# EAGLE design MainBoardR4 (EAGLE 6.5.0)
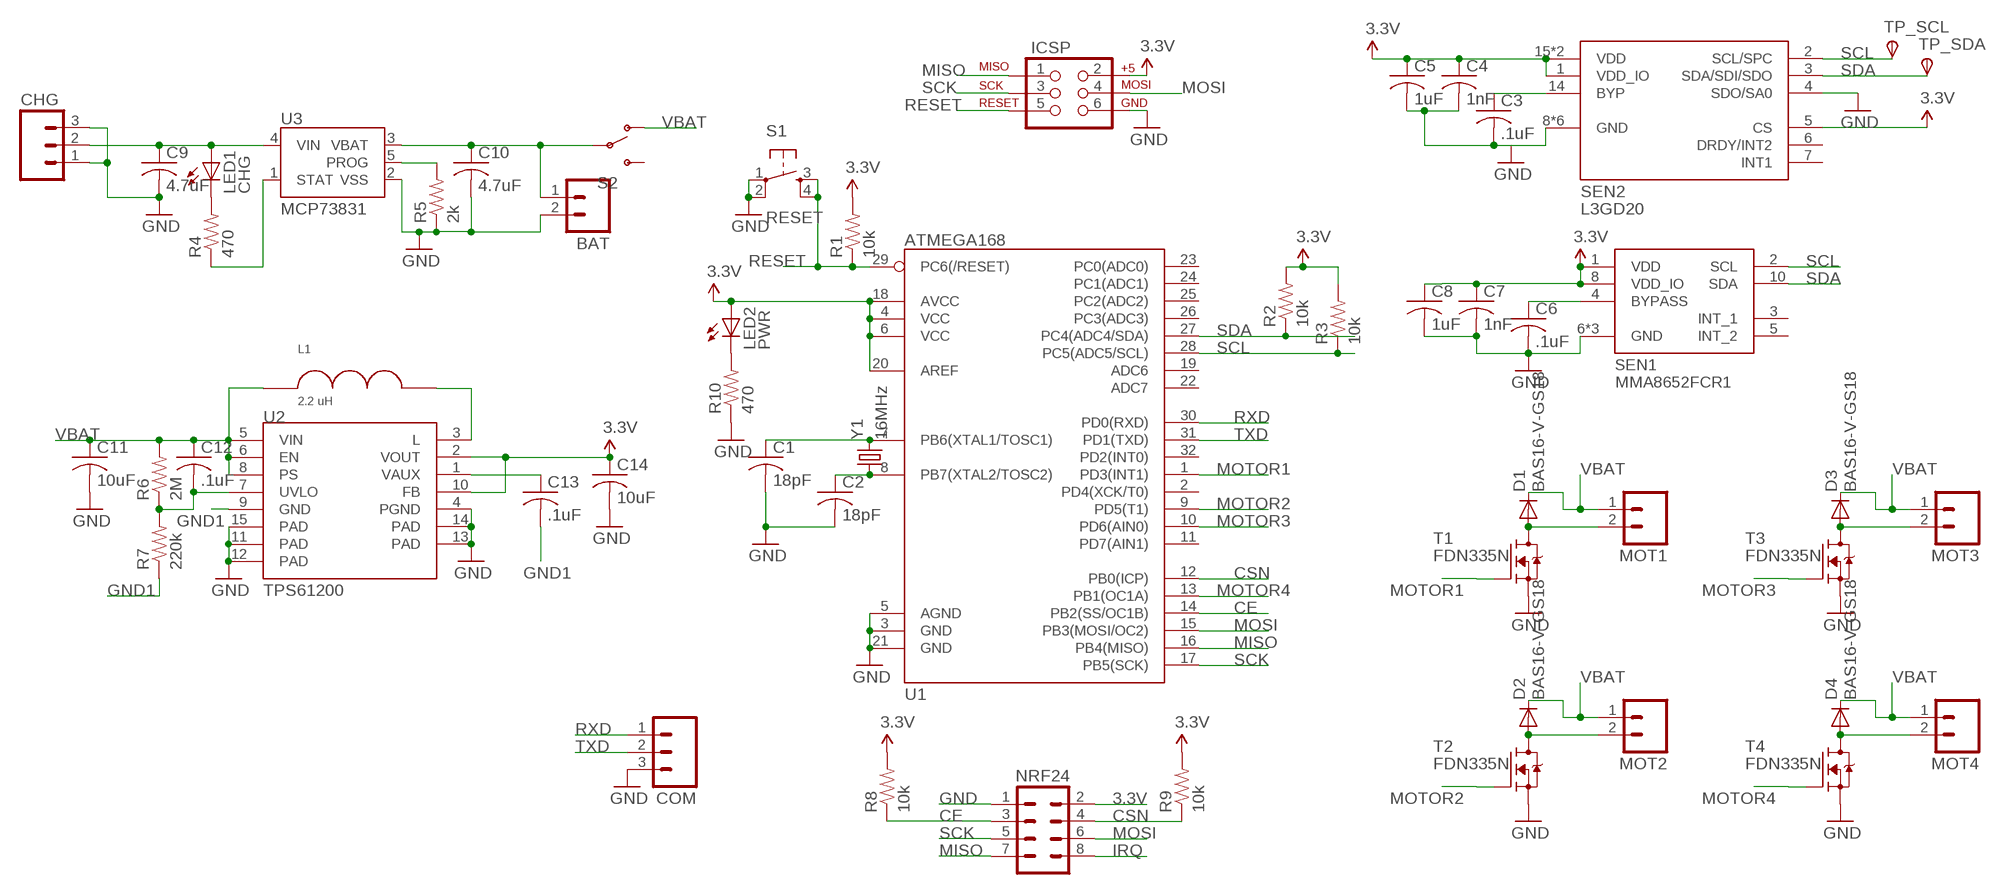
[diagram p0: schematic, sheet 1]

## Parts
BAT  M02LOCK_LONGPADS  [1X02_LOCK_LONGPADS]
C1  18pF  C-USC0805  [C0805]
C2  18pF  C-USC0805  [C0805]
C3  .1uF  C-USC0805  [C0805]
C4  1nF  C-USC0805  [C0805]
C5  1uF  C-USC0805  [C0805]
C6  .1uF  C-USC0805  [C0805]
C7  1nF  C-USC0805  [C0805]
C8  1uF  C-USC0805  [C0805]
C9  4.7uF  C-USC0805  [C0805]
C10  4.7uF  C-USC0805  [C0805]
C11  10uF  C-USC0805  [C0805]
C12  .1uF  C-USC0805  [C0805]
C13  .1uF  C-USC0805  [C0805]
C14  10uF  C-USC0805  [C0805]
CHG  M03LONGPADS  [1X03_LONGPADS]
COM  M03LONGPADS  [1X03_LONGPADS]
D1  BAS16-V-GS18  [SOT23]
D2  BAS16-V-GS18  [SOT23]
D3  BAS16-V-GS18  [SOT23]
D4  BAS16-V-GS18  [SOT23]
ICSP  AVR_SPI_PRG_62X3_LOCK  [2X3_LOCK]
L1  2.2 uH  BRHL2518T2R2M  [2518]
LED1  CHG  LED1206  [LED-1206]
LED2  PWR  LED1206  [LED-1206]
MOT1  M02LOCK_LONGPADS  [1X02_LOCK_LONGPADS]
MOT2  M02LOCK_LONGPADS  [1X02_LOCK_LONGPADS]
MOT3  M02LOCK_LONGPADS  [1X02_LOCK_LONGPADS]
MOT4  M02LOCK_LONGPADS  [1X02_LOCK_LONGPADS]
NRF24  M04X2  [2X4]
R1  10k  RESISTOR0805-RES  [0805]
R2  10k  RESISTOR0805-RES  [0805]
R3  10k  RESISTOR0805-RES  [0805]
R4  470  RESISTOR0805-RES  [0805]
R5  2k  RESISTOR0805-RES  [0805]
R6  2M  RESISTOR0805-RES  [0805]
R7  220k  RESISTOR0805-RES  [0805]
R8  10k  RESISTOR0805-RES  [0805]
R9  10k  RESISTOR0805-RES  [0805]
R10  470  RESISTOR0805-RES  [0805]
S1  RESET  TAC_SWITCHSMD  [TACTILE_SWITCH_SMD]
S2  SWITCH-SPST-SMD-A  [SWITCH-SPST-SMD-A]
SEN1  MMA8652FCR1  [10_PIN_DFN]
SEN2  L3GD20  [LGA-16]
T1  FDN335N  [SOT23]
T2  FDN335N  [SOT23]
T3  FDN335N  [SOT23]
T4  FDN335N  [SOT23]
TP_SCL  TPSTP14SQ  [TP14SQ]
TP_SDA  TPSTP14SQ  [TP14SQ]
U1  ATMEGA168  [TQFP32-08]
U2  TPS61200  [QFN-10_PAD]
U3  MCP73831  [SOT23-5]
Y1  16MHz  CRYSTAL10.5X4.8  [CRYSTAL-SMD-10.5X4.8-2PIN]

## Nets
3.3V: C4.1 C5.1 C7.1 C8.1 C14.1 ICSP.2 LED2.A NRF24.2 R1.2 R2.2 R3.2 R8.2 R9.2 SEN1.1(VDD) SEN1.8(VDD_IO) SEN2.1(VDD_IO) SEN2.5(CS) SEN2.15(VDD) SEN2.16(VDD) U1.4(VCC) U1.6(VCC) U1.18(AVCC) U1.20(AREF) U2.2(VOUT) U2.10(FB)
BAT+: BAT.1 C10.1 S2.2(P) U3.3(VBAT)
CE: NRF24.3 R8.1 U1.14(PB2(SS/OC1B))
CSN: NRF24.4 R9.1 U1.12(PB0(ICP))
GND: BAT.2 C1.2 C2.2 C3.2 C4.2 C5.2 C6.2 C7.2 C8.2 C9.2 C10.2 C11.2 C14.2 CHG.1 CHG.3 COM.3 ICSP.6 NRF24.1 R5.1 R10.1 S1.1 S1.2 SEN1.6(GND) SEN1.7(GND) SEN1.9(GND) SEN2.4(SDO/SA0) SEN2.8(GND) SEN2.9(GND) SEN2.10(GND) SEN2.11(GND) SEN2.12(GND) SEN2.13(GND) T1.2(S) T2.2(S) T3.2(S) T4.2(S) U1.3(GND) U1.5(AGND) U1.21(GND) U2.4(PGND) U2.11(PAD) U2.12(PAD) U2.13(PAD) U2.14(PAD) U2.15(PAD) U3.2(VSS)
GND1: C13.2 R7.1 U2.9(GND)
IRQ: NRF24.8
MISO: ICSP.1 NRF24.7 U1.16(PB4(MISO))
MOSI: ICSP.4 NRF24.6 U1.15(PB3(MOSI/OC2))
MOT1-: D1.1(A) MOT1.2 T1.3(D)
MOT2-: D2.1(A) MOT2.2 T2.3(D)
MOT3-: D3.1(A) MOT3.2 T3.3(D)
MOT4-: D4.1(A) MOT4.2 T4.3(D)
MOTOR1: T1.1(G) U1.1(PD3(INT1))
MOTOR2: T2.1(G) U1.9(PD5(T1))
MOTOR3: T3.1(G) U1.10(PD6(AIN0))
MOTOR4: T4.1(G) U1.13(PB1(OC1A))
N$1: C3.1 SEN2.14(BYP)
N$2: C1.1 U1.7(PB6(XTAL1/TOSC1)) Y1.P$2
N$3: C2.1 U1.8(PB7(XTAL2/TOSC2)) Y1.P$1
N$5: LED1.C R4.2
N$6: C6.1 SEN1.4(BYPASS)
N$10: R4.1 U3.1(STAT)
N$12: R5.2 U3.5(PROG)
N$13: C13.1 U2.1(VAUX)
N$14: C12.2 R6.1 R7.2 U2.7(UVLO)
N$15: LED2.C R10.2
N$16: L1.P$2 U2.3(L)
RESET: ICSP.5 R1.1 S1.3 S1.4 U1.29(PC6(/RESET))
RXD: COM.1 U1.30(PD0(RXD))
SCK: ICSP.3 NRF24.5 U1.17(PB5(SCK))
SCL: R3.1 SEN1.2(SCL) SEN2.2(SCL/SPC) TP_SCL.TP(PP) U1.28(PC5(ADC5/SCL))
SDA: R2.1 SEN1.10(SDA) SEN2.3(SDA/SDI/SDO) TP_SDA.TP(PP) U1.27(PC4(ADC4/SDA))
TXD: COM.2 U1.31(PD1(TXD))
VBAT: C11.1 C12.1 D1.3(C) D2.3(C) D3.3(C) D4.3(C) L1.P$1 MOT1.1 MOT2.1 MOT3.1 MOT4.1 R6.2 S2.1(O) U2.5(VIN) U2.6(EN) U2.8(PS)
VIN: C9.1 CHG.2 LED1.A U3.4(VIN)
Unconnected: S2.3(S) SEN1.3(INT_1) SEN1.5(INT_2) SEN2.6(DRDY/INT2) SEN2.7(INT1) U1.2(PD4(XCK/T0)) U1.11(PD7(AIN1)) U1.19(ADC6) U1.22(ADC7) U1.23(PC0(ADC0)) U1.24(PC1(ADC1)) U1.25(PC2(ADC2)) U1.26(PC3(ADC3)) U1.32(PD2(INT0))

## Library data of the parts
BAT MOT1-MOT4 = SparkFun:M02: Header 2 Standard 2-pin 0.1" header. Use with straight break away headers (SKU : PRT-00116), right angle break away headers (PRT-00553), swiss pins (PRT-00743), machine pins (PRT-00117), and female headers (PRT-00115). Molex polarized connector foot print use with SKU : PRT-08233 with associated crimp pins and housings.
C1-C14 = rcl:C-US: CAPACITOR, American symbol
CHG COM = SparkFun:M03: Header 3 Standard 3-pin 0.1" header. Use with straight break away headers (SKU : PRT-00116), right angle break away headers (PRT-00553), swiss pins (PRT-00743), machine pins (PRT-00117), and female headers (PRT-00115). Molex polarized connector foot print use with SKU : PRT-08232 with associated crimp pins and housings.
D1-D4 = diode:BAS16-V-GS18
ICSP = SparkFun:AVR_SPI_PRG_6: AVR ISP 6 Pin This is the reduced ISP connector for AVR programming. Common on Arduino. This footprint will take up less PCB space and can be used with a 10-pin to 6-pin adapter such as SKU: BOB-08508
L1 = inductors:BRHL2518T2R2M
LED1 LED2 = SparkFun:LED: LEDs Standard schematic elements and footprints for 5mm, 3mm, 1206, and 0603 sized LEDs. 5mm - Spark Fun Electronics SKU : COM-00529 (and others)
NRF24 = SparkFun:M04X2
R1-R10 = SparkFun:RESISTOR: Resistor Basic schematic elements and footprints for 0603, 1206, and PTH resistors.
S1 = SparkFun:TAC_SWITCH: Momentary Switch Button commonly used for reset or general input. Spark Fun Electronics SKU : COM-00097
S2 = SparkFun:SWITCH-SPST: SPST Switch Simple slide switch. Spark Fun Electronics SKU : COM-00102
SEN1 = Sensors:MMA8652FCR1
SEN2 = Sensors:L3GD20
T1-T4 = transistor-fet:FDN335N
TP_SCL TP_SDA = testpad:TPS: TEST PIN
U1 = SparkFun:ATMEGA168
U2 = SparkFun:TPS61200: DC to DC Booster
U3 = SparkFun:MCP73831: Microchip's MCP73831 Miniature single cell, fully integrated Li-Ion, Li-polymer charge management controller http://ww1.microchip.com/downloads/en/DeviceDoc/21984a.pdf
Y1 = SparkFun:CRYSTAL: Crystals Various standard crystals. Proven footprints. Spark Fun Electronics SKU : COM-00534

## Board
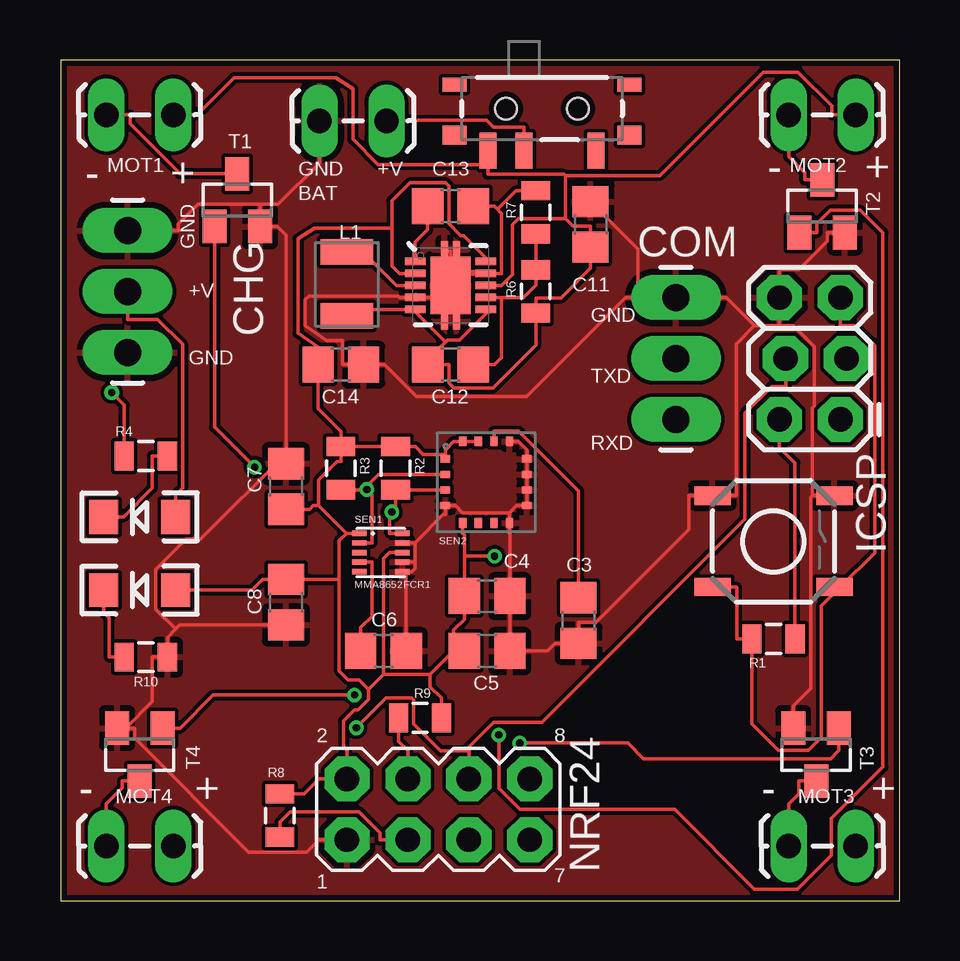
[diagram p1: board, top side]
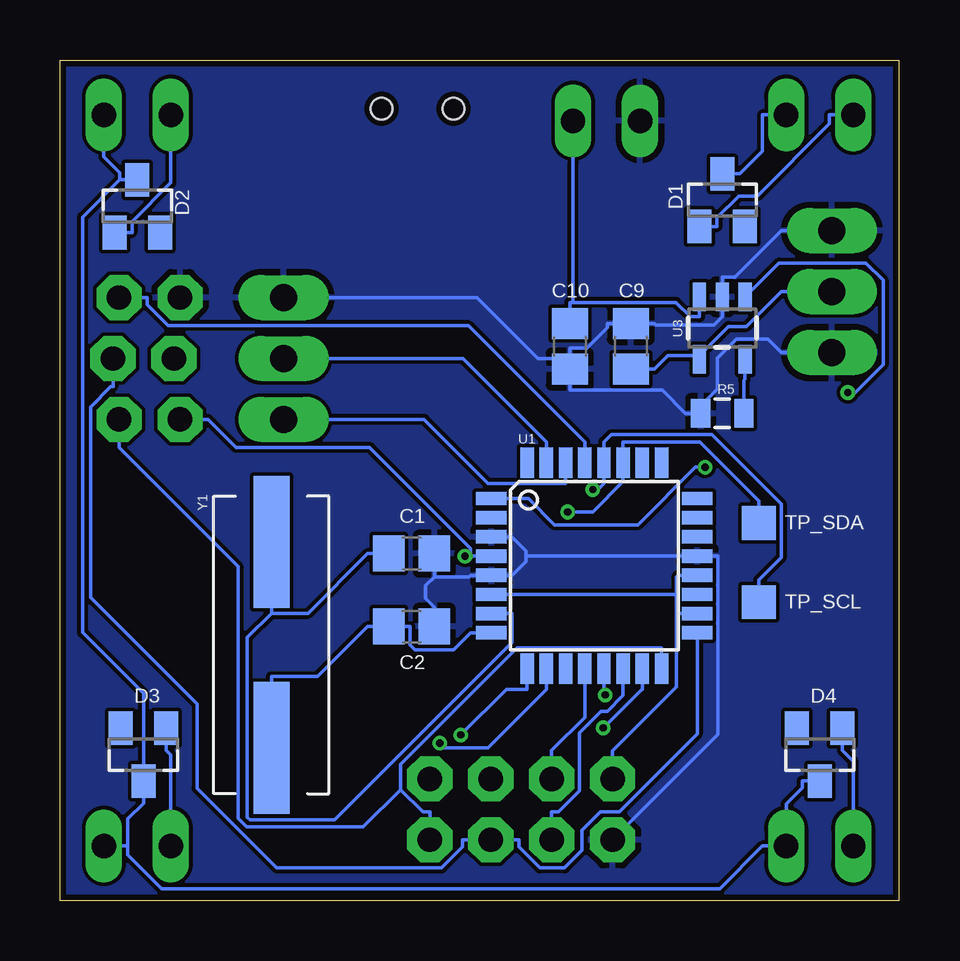
[diagram p2: board, bottom side, seen from below]

Size 34.98 x 35.04 mm. Coordinates in mm from the lower left corner, seen from the top.
Outline: 0,0 34.98,0 34.98,35.04 0,35.04 0,0
Copper layers (1*16): Top 0.035mm / dielectric 1.5mm / Bottom 0.035mm
Design rules "Fusion_eagle_rule_v1.1": minimum track width 6mil, minimum drill 12mil, track to track 6mil, track to pad 6mil, pad to pad 6mil, via to via 6mil, smd to smd 0mil, copper to edge 10mil, drill to drill 10mil, minimum pad ring 10mil, minimum via ring 6mil, stop-mask expansion 2mil, vias tented up to drill 100mil, thermal gap 10mil

### Footprints (pad centres in the part's own frame; a part is rotated, then mirrored left to right if it is on the bottom)
1X02_LOCK_LONGPADS = drill 1.016 long: 1 -0.127,0; 2 2.667,0
C0805 = smd 1.3 x 1.5: 1 -0.95,0; 2 0.95,0
1X03_LONGPADS = drill 1.118 pad 1.88 long: 1 0,0; 2 2.54,0; 3 5.08,0
SOT23 = smd 1 x 1.4: 1 -0.95,-1.1; 2 0.95,-1.1; 3 0,1.1
2X3_LOCK = drill 1.016 pad 1.88 octagon: 1 0,0; 2 0,2.54; 3 2.54,-0.254; 4 2.54,2.286; 5 5.08,0; 6 5.08,2.54
2518 = smd 1.067 x 2.184: P$1 -0.254,0; P$2 2.413,0
LED-1206 = smd 1.2 x 1.4: A -1.5,0; C 1.5,0
2X4 = drill 1.016 pad 1.88 octagon: 1 -3.81,-1.27; 2 -3.81,1.27; 3 -1.27,-1.27; 4 -1.27,1.27; 5 1.27,-1.27; 6 1.27,1.27; 7 3.81,-1.27; 8 3.81,1.27
0805 = smd 0.8 x 1.2: 1 -0.9,0; 2 0.9,0
TACTILE_SWITCH_SMD = smd 1.524 x 0.762: 1 -2.54,1.905; 2 2.54,1.905; 3 -2.54,-1.905; 4 2.54,-1.905
SWITCH-SPST-SMD-A = smd 0.7 x 1.5: 1 -2.25,-1.75; 2 -0.75,-1.75; 3 2.25,-1.75 | smd 1 x 0.6: GND1 -3.65,1; GND3 3.65,1 | smd 1 x 0.8: GND2 -3.65,-1.1; GND4 3.65,-1.1 | hole 0.9: -1.5,0; 1.5,0
10_PIN_DFN = smd 0.6 x 0.225: 1 0,1.6; 2 0,1.2; 3 0,0.8; 4 0,0.4; 5 0,0; 6 1.8,0; 7 1.8,0.4; 8 1.8,0.8; 9 1.8,1.2; 10 1.8,1.6
LGA-16 = smd 0.4 x 0.3: 1 -0.725,2.675; 2 -0.725,2.025; 3 -0.725,1.375; 4 -0.725,0.725; 9 2.675,0.725; 10 2.675,1.375; 11 2.675,2.025; 12 2.675,2.675 | smd 0.3 x 0.4: 5 0,0; 6 0.65,0; 7 1.3,0; 8 1.95,0; 13 1.95,3.4; 14 1.3,3.4; 15 0.65,3.4; 16 0,3.4
TP14SQ = smd 1.4 x 1.4: TP 0,0
TQFP32-08 = smd 1.27 x 0.559: 1 -4.293,2.8; 2 -4.293,2; 3 -4.293,1.2; 4 -4.293,0.4; 5 -4.293,-0.4; 6 -4.293,-1.2; 7 -4.293,-2; 8 -4.293,-2.8; 17 4.293,-2.8; 18 4.293,-2; 19 4.293,-1.2; 20 4.293,-0.4; 21 4.293,0.4; 22 4.293,1.2; 23 4.293,2; 24 4.293,2.8 | smd 0.559 x 1.27: 9 -2.8,-4.293; 10 -2,-4.293; 11 -1.2,-4.293; 12 -0.4,-4.293; 13 0.4,-4.293; 14 1.2,-4.293; 15 2,-4.293; 16 2.8,-4.293; 25 2.8,4.293; 26 2,4.293; 27 1.2,4.293; 28 0.4,4.293; 29 -0.4,4.293; 30 -1.2,4.293; 31 -2,4.293; 32 -2.8,4.293
QFN-10_PAD = smd 0.297 x 0.85: 1 -1,-1.475; 2 -0.5,-1.475; 3 0,-1.475; 4 0.5,-1.475; 5 1,-1.475; 6 1,1.475; 7 0.5,1.475; 8 0,1.475; 9 -0.5,1.475; 10 -1,1.475 | smd 0.7 x 0.28: 11 -1.5,0.25; 12 -1.5,-0.25; 13 1.5,0.25; 14 1.5,-0.25 | smd 2.4 x 1.65: 15 0,0
SOT23-5 = smd 0.55 x 1.2: 1 -0.95,-1.3; 2 0,-1.3; 3 0.95,-1.3; 4 0.95,1.3; 5 -0.95,1.3
CRYSTAL-SMD-10.5X4.8-2PIN = smd 5.5 x 1.5: P$1 -4.3,0; P$2 4.3,0

### Placement (x,y rotation side)
BAT  13.46,32.51 180 top
C1  20.32,14.48 0 bottom
C2  20.32,11.43 0 bottom
C3  21.59,11.68 270 top
C4  17.78,12.7 0 top
C5  17.78,10.41 0 top
C6  13.46,10.41 0 top
C7  9.4,17.27 90 top
C8  9.4,12.45 270 top
C9  11.18,23.11 90 bottom
C10  13.72,23.11 270 bottom
C11  22.1,28.19 90 top
C12  16.26,22.35 0 top
C13  16.26,28.96 0 top
C14  11.68,22.35 0 top
CHG  2.79,22.86 90 top
COM  25.65,20.07 90 top
D1  7.37,29.21 0 bottom
D2  31.75,28.96 0 bottom
D3  31.5,6.1 180 bottom
D4  3.3,6.1 180 bottom
ICSP  32.51,20.07 90 top
L1  11.94,24.64 90 top
LED1  3.3,16 180 top
LED2  3.3,12.95 180 top
MOT1  4.57,32.77 180 top
MOT2  33.02,32.77 180 top
MOT3  33.02,2.29 180 top
MOT4  4.57,2.29 180 top
NRF24  15.75,3.81 0 top
R1  29.72,10.92 0 top
R2  13.97,18.03 90 top
R3  11.68,18.03 90 top
R4  3.56,18.54 0 top
R5  7.37,20.32 0 bottom
R6  19.81,25.4 270 top
R7  19.81,28.7 270 top
R8  9.14,3.56 90 top
R9  14.99,7.62 0 top
R10  3.56,10.16 180 top
S1  29.72,14.99 0 top
S2  20.07,33.02 0 top
SEN1  12.45,13.72 0 top
SEN2  16.76,15.75 0 top
T1  7.37,29.21 0 top
T2  31.75,28.96 0 top
T3  31.5,6.1 180 top
T4  3.3,6.1 180 top
TP_SCL  5.84,12.45 0 bottom
TP_SDA  5.84,15.75 0 bottom
U1  12.7,13.97 0 bottom
U2  16.26,25.65 270 top
U3  7.37,23.88 180 bottom
Y1  26.16,10.67 90 bottom

### Tracks (layer width: path | path; a pad name or v marks a point on that pad's centre or on a via)
3.3V  (via drill 0.3 pad 0.61)
  Top 0.152: R9.2 15.89,8.45 15.41,8.92 15.41,9.44 | 15.41,9.44 16.39,10.41 | 13.47,9.44 15.41,9.44 | 13.47,9.44 12.84,8.8 | 13.47,9.44 13.47,14.27 13.72,14.52 SEN1.8 | 13.82,28.04 10.59,28.04 9.9,27.6 9.9,23.66 10.73,23.08 C14.1 10.73,20.51 11.68,19.56 11.68,19.25 R3.2 | 13.82,28.04 13.82,26.46 14.13,26.15 U2.2 | U2.10 17.73,26.79 16.79,27.73 16.68,27.73 16.18,28.22 16.18,29.8 16.05,29.93 14.56,29.93 13.82,29.19 13.82,28.04 | 16.39,10.41 16.39,11.28 16.83,11.72 C4.1 16.83,13.68 16.83,14.37 | C5.1 16.39,10.41 | 16.83,14.37 16.83,15.25 16.76,15.32 SEN2.5 | 16.83,14.37 v18.09,14.37 | SEN2.15 17.14,19.15 SEN2.16 16.39,19.15 16.04,18.8 16.04,18.61 | 10.76,16.47 11.92,15.32 | 10.76,16.47 10.52,16.47 10.38,16.32 C7.1 | 10.76,16.47 10.76,17.54 11.53,18.3 11.68,18.3 R3.2 | R3.2 13.14,18.93 R2.2 14.09,18.93 14.8,18.93 15.12,18.61 16.04,18.61 | 12.84,8.8 12.84,8.4 12.4,7.96 12.26,7.96 11.79,7.49 11.79,6.39 11.94,6.25 NRF24.2 10.77,5.08 10.15,4.46 R8.2 | 11.62,13.4 11.62,9.59 11.99,9.21 12.43,9.21 12.84,8.8 | 11.62,13.4 10.38,13.4 C8.1 8.42,13.4 7.98,12.95 LED2.A | 11.62,13.4 11.62,15.01 11.92,15.32 | SEN1.1 11.92,15.32 | SEN2.1 16.04,18.61 | ICSP.2 29.97,18.9 30.62,18.25 R1.2
  Bottom 0.152: 17.86,14.37 v18.09,14.37 | NRF24.2 11.94,6.25 9.27,8.91 9.27,11.97 | U1.18 9.27,11.97 | 9.27,12.77 16.13,12.77 U1.6 | 9.27,12.77 9.27,13.49 9.2,13.57 U1.20 | 9.27,12.77 9.27,11.97 | ICSP.2 28.8,20.07 27.64,18.9 22.06,18.9 17.86,14.69 17.86,14.37 | U1.4 17.86,14.37
BAT+
  Top 0.152: S2.2 19.32,32.25 18.05,32.25 17.75,32.55 14.62,32.55 14.58,32.51 BAT.1
  Bottom 0.152: 13.59,24.94 13.72,24.94 C10.1 | 13.59,24.94 9.29,24.94 8.69,24.35 8.32,24.35 U3.3 | 13.59,24.94 13.59,30.76 BAT.1
CE
  Top 0.152: NRF24.3 13.31,2.54 13.31,2.83 12.43,3.71 9.57,3.71 9.14,3.29 R8.1
  Bottom 0.152: 11.5,8.81 | 11.5,8.81 11.5,8.56 12.16,7.9 12.41,7.9 13.31,7 13.31,4.58 14.19,3.71 14.48,3.71 NRF24.3 | U1.14 11.5,8.81
CSN
  Top 0.152: NRF24.4 14.48,6.25 14.09,6.64 R9.1
  Bottom 0.152: U1.12 13.1,7.64 14.48,6.26 14.48,6.25 NRF24.4
GND
  Top 0.152: 9.4,18.66 9.4,27.76 9.04,28.11 T1.2 8.32,29.04 | CHG.3 4.9,27.94 4.9,28.21 5.73,29.04 8.32,29.04 | 24.07,25.15 24.07,27.17 C11.2 | 24.07,25.15 23.55,25.15 19.43,21.03 14.84,21.03 13.51,22.35 C14.2 11.76,22.35 11.76,23.09 11.75,23.35 11.1,23.35 10.2,23.99 10.2,25.06 10.35,25.21 14.07,25.21 14.13,25.15 U2.4 15.11,25.15 15.44,25.15 15.86,24.73 16.01,24.73 16.01,24.44 | 24.07,25.15 24.6,25.15 COM.3 27.76,25.15 | 28.93,23.98 28.17,23.22 28.17,16.89 S1.1 26.19,16.89 26.19,15.47 22.33,11.61 21.59,11.61 C3.2 21.1,10.73 20.61,10.73 20.29,10.41 C5.2 C4.2 18.73,15.3 18.71,15.32 SEN2.8 18.71,16.18 | 29.97,23.98 28.93,23.98 | 27.76,25.15 | 27.76,25.15 28.93,23.98 | 4.79,11.32 3.97,12.14 3.97,13.81 5.24,15.07 5.84,15.07 9.4,18.63 9.4,18.66 | 18.71,16.18 16.76,16.18 16.47,16.47 SEN2.4 16.04,16.09 15.95,16.09 14.78,14.92 | 18.71,16.18 19.01,16.47 SEN2.9 SEN2.10 SEN2.11 SEN2.12 19.44,18.61 19.44,18.8 19.09,19.15 SEN2.13 | BAT.2 10.79,30.76 9.07,29.04 8.32,29.04 | 14.78,14.92 14.78,14.12 | 4.79,11.32 4.96,11.5 8.42,11.5 C8.2 | 4.79,11.32 4.46,10.99 R10.1 3.83,10.16 3.83,8.31 2.72,7.2 | C7.2 9.4,18.66 | 2.72,7.2 3.08,7.2 3.08,6.78 7.83,2.03 10.26,2.03 10.77,2.54 NRF24.1 | T4.2 2.72,7.2 | T3.2 30.55,8.12 31.27,8.85 31.27,16.82 31.34,16.89 | 31.34,16.89 31.38,16.89 S1.2 | SEN1.9 14.78,14.92 | 14.51,13.72 14.63,13.72 14.78,13.86 14.78,14.12 | 31.34,16.89 31.34,20.55 31.42,20.63 31.42,23.11 30.56,23.98 29.97,23.98 | 29.97,23.98 ICSP.6 29.97,26.31 30.79,26.31 31.97,27.5 31.97,27.86 T2.2 | U2.11 16.51,26.57 16.46,26.57 16.26,26.37 | 16.26,26.37 16.26,27.08 16.08,27.08 U2.12 | 16.26,26.37 U2.15 16.26,25.54 16.26,24.94
  Top 0.152: 16.01,24.44 16.26,24.69 16.26,24.94 | U2.14 16.01,24.44 | SEN1.7 14.78,14.12 | C6.2 14.41,13.62 14.51,13.72 | SEN1.6 14.51,13.72 | U2.13 16.51,24.73 16.46,24.73 16.26,24.94
  Bottom 0.152: CHG.3 4.9,27.94 6.84,26 7.37,26 U3.2 7.37,24.76 7.37,24.35 7.72,23.99 10.13,23.99 10.2,24.06 C9.2 12.15,24.06 12.15,23.89 13.01,23.04 13.72,23.04 13.72,22.6 | 15.55,14.37 15.55,14.15 16.13,13.57 U1.5 17.86,13.57 17.93,13.5 19.37,13.5 | 15.55,14.37 15.55,14.59 16.13,15.17 U1.3 | 15.55,14.37 9.27,14.37 U1.21 7.54,14.37 7.54,6.93 NRF24.1 | 13.72,22.6 15.04,22.6 17.59,25.15 COM.3 | 13.72,22.6 C10.2 13.72,21.29 9.86,21.29 8.89,20.32 8.58,20.32 | 19.37,13.5 19.73,13.14 19.73,12.6 19.37,12.24 C2.2 | C1.2 19.37,13.5 | CHG.1 4.9,22.86 5.46,23.41 6.78,23.41 7.57,22.62 7.57,21.33 8.58,20.32 | R5.1 8.58,20.32
  pour Bottom: 0,35.05 35.05,35.05 35.05,0 0,0
  pour Top: 0,35.05 35.05,35.05 35.05,0 0,0
GND1
  Top 0.152: 18.21,28.83 18.09,28.96 C13.2 | 18.21,28.83 18.39,28.66 18.39,26.15 U2.9 | 18.21,28.83 18.98,29.6 R7.1
MISO
  Bottom 0.152: 20.77,4.63 20.77,5.7 15.93,10.54 9.9,10.54 U1.16 | ICSP.1 32.51,18.9 27.55,13.94 27.55,3.44 27.19,3.08 22.33,3.08 20.77,4.63 | 20.77,4.63 19.85,3.71 19.56,3.71 NRF24.7
MOSI  (via drill 0.3 pad 0.61)
  Top 0.152: 17.02,6.25 17.02,6.42 18.05,7.45 20.07,7.45 28.53,15.91 28.53,20.33 29.64,21.44 30.23,21.44 ICSP.4 | 17.02,6.25 15.85,6.25 14.71,7.38 14.71,8.37 14.63,8.45 13.57,8.45 v12.33,7.21 | NRF24.6 17.02,6.25
  Bottom 0.152: v12.33,7.21 10.72,8.81 10.7,8.81 U1.15
MOT1-
  Top 0.152: MOT1.2 2.9,32.77 2.9,32.4 4.98,30.31 T1.3
  Bottom 0.152: D1.1 7.59,28.11 7.59,28.47 6.68,29.38 5.91,29.38 2.9,32.4 2.9,32.77 MOT1.2
MOT2-
  Top 0.152: MOT2.2 30.35,31.01 31.02,30.34 31.02,30.06 T2.3
  Bottom 0.152: D2.1 31.97,27.86 31.97,28.31 30.35,29.93 MOT2.2
MOT3-
  Top 0.152: MOT3.2 30.35,4.04 30.77,4.45 30.77,5 T3.3
  Bottom 0.152: D3.1 30.55,6.27 30.35,6.07 MOT3.2
MOT4-
  Top 0.152: MOT4.2 1.91,4.04 2.57,4.71 2.57,5 T4.3
  Bottom 0.152: D4.1 2.35,6.27 1.91,5.82 MOT4.2
MOTOR1  (via drill 0.3 pad 0.61)
  Top 0.152: T1.1 6.42,19.75 v8.09,18.07
  Bottom 0.152: v8.09,18.07 8.49,18.07 10.89,15.67 14.36,15.67 15.46,16.77 U1.1
MOTOR2  (via drill 0.3 pad 0.61)
  Top 0.152: T2.1 31.53,27.86 31.53,28.22 32.09,28.79 33.35,28.79 34.28,27.86 34.28,5.58 32.13,3.43 32.13,1.89 30.72,0.48 28.93,0.48 25.6,3.81 19.15,3.81 18.27,4.69 v18.27,6.91
  Bottom 0.152: U1.9 15.5,8.81 16.37,8.81 v18.27,6.91
MOTOR3  (via drill 0.3 pad 0.61)
  Top 0.152: T3.1 32.45,6.27 32.1,5.92 24.31,5.92 23.66,6.58 v19.14,6.58
  Bottom 0.152: U1.10 14.7,8.81 17.13,6.38 18.95,6.38 v19.14,6.58
MOTOR4  (via drill 0.3 pad 0.61)
  Top 0.152: v12.25,8.58 6.37,8.58 4.98,7.2 T4.1
  Bottom 0.152: v12.25,8.58 12.3,8.63 12.3,8.81 U1.13
N$1
  Top 0.152: SEN2.14 18.06,19.58 19.1,19.58 21.59,17.08 C3.1
N$2
  Bottom 0.152: 26.16,11.99 27.16,10.99 27.16,3.49 27.06,3.38 23.52,3.38 16.13,10.78 16.13,11.97 U1.7 | 26.16,11.99 24.64,11.99 22.15,14.48 C1.1 | Y1.P$2 26.16,11.99
N$3
  Bottom 0.152: U1.8 17.86,11.17 18.57,10.45 20.18,10.45 20.39,10.66 20.39,11.43 C2.1 22.15,11.43 24.23,9.35 26.16,9.35 Y1.P$1
N$5
  Top 0.152: LED1.C 2.63,16 3.83,17.2 3.83,18.54 R4.2
N$6
  Top 0.152: C6.1 12.51,11.39 12.97,11.86 12.97,14.12 SEN1.4
N$10  (via drill 0.3 pad 0.61)
  Top 0.152: R4.1 2.66,20.67 v2.13,21.19
  Bottom 0.152: U3.1 5.01,26.59 1.37,26.59 0.65,25.86 0.65,22.35 1.81,21.19 v2.13,21.19
N$12
  Bottom 0.152: U3.5 6.42,21.75 6.47,21.7 R5.2
N$13
  Top 0.152: C13.1 15.31,27.98 14.78,27.45 U2.1
N$14
  Top 0.152: 18.39,25.15 19.3,25.15 19.81,25.67 R6.1 R7.2 | 18.39,25.15 18.31,25.15 U2.7 | 18.39,25.15 18.39,22.65 18.09,22.35 C12.2
N$15
  Top 0.152: LED2.C 1.8,12.03 2.03,11.8 2.03,10.16 R10.2
N$16
  Top 0.152: L1.P$2 12.91,26.74 14,25.65 U2.3
N$17
  Top 0.254: 17.53,26.16 16.76,26.16
RESET
  Top 0.152: 32.51,13.08 31.72,12.29 31.72,6.81 31.17,6.27 29.93,6.27 28.82,7.38 R1.1 28.19,10.92 28.19,13.06 28.17,13.08 S1.3 | ICSP.5 32.51,23.98 33.1,23.98 33.94,23.14 33.94,14.51 32.51,13.08 | S1.4 32.51,13.08
  Bottom 0.152: ICSP.5 31.34,25.15 31.34,24.85 30.47,23.98 17.95,23.98 13.1,19.13 U1.29
RXD
  Bottom 0.152: U1.30 13.9,17.4 17.13,17.4 19.79,20.07 COM.1
SCK
  Bottom 0.152: U1.17 8.41,6.95 11.65,3.71 12.45,3.71 13.21,2.95 13.21,2.1 13.94,1.37 14.97,1.37 15.85,2.25 15.85,2.54 NRF24.5 18.19,2.54 18.19,2.25 19.06,1.37 25.93,1.37 29.26,4.7 29.26,8.21 33.7,12.64 33.7,20.59 32.85,21.44 32.77,21.44 ICSP.3
SCL  (via drill 0.3 pad 0.61)
  Top 0.152: v12.75,17.13 12.51,17.13 R3.1 | v12.75,17.13 v12.76,17.14 12.76,17.27 13.26,17.77 SEN2.2 | v12.75,17.13 12.97,16.91 12.97,14.92 SEN1.2
  Bottom 0.152: TP_SCL.TP 5.84,13.38 4.91,14.3 4.91,16.55 7.8,19.43 11.99,19.43 12.3,19.13 U1.28 12.3,18.13 12.3,17.4 12.55,17.14 v12.76,17.14
SDA  (via drill 0.3 pad 0.61)
  Top 0.152: SEN1.10 13.72,15.32 13.72,16.12 v13.8,16.21 13.97,16.37 13.97,16.5 R2.1 14.8,17.13 14.81,17.12 SEN2.3
  Bottom 0.152: TP_SDA.TP 5.84,16.68 8.29,19.13 11.5,19.13 U1.27 11.5,17.91 11.5,17.48 12.77,16.21 v13.8,16.21
TXD
  Bottom 0.152: U1.31 14.7,19.13 18.18,22.61 COM.2
VBAT
  Top 0.152: U2.8 18.39,25.65 18.84,26.11 18.84,28.18 19.09,28.43 21.05,28.43 | 16.05,23.3 15.74,22.99 15.74,22.35 | U2.6 17.73,24.48 16.64,23.38 16.14,23.38 16.05,23.3 | 16.05,23.3 14.78,24.56 14.78,24.64 | 14.78,24.64 U2.5 | 14.78,24.64 12.91,24.64 L1.P$1 | 15.74,22.35 16.18,22.35 16.18,21.58 16.39,21.37 18.02,21.37 19.81,23.16 R6.2 19.81,25.13 20.86,25.13 22.1,26.36 C11.1 22.1,28.12 21.36,28.12 21.05,28.43 | C12.1 15.74,22.35 | 21.05,30.23 21.05,28.43 | 21.05,30.23 21,30.29 17.82,30.29 17.82,30.78 | 21.05,30.23 24.98,30.23 29.3,34.55 30.75,34.55 32.16,33.14 32.16,32.77 MOT2.1 | MOT1.1 5.69,32.77 7.25,34.32 11.47,34.32 12.19,33.85 12.19,31.74 13.24,30.69 17.73,30.69 17.82,30.78 | S2.1 17.82,30.78
  Bottom 0.152: 32.16,2.29 32.16,3.41 31.5,4.07 D3.3 31.5,8.64 34.03,11.18 34.03,28.5 32.48,30.06 | 32.16,2.29 32.16,1.92 30.75,0.5 7.47,0.5 5.69,2.29 MOT4.1 4.7,3.16 4.7,4.04 4.03,4.71 4.03,5 D4.3 | MOT3.1 32.16,2.29 | D2.3 32.48,30.06 | MOT2.1 33.15,31.01 32.48,30.34 32.48,30.06 | D1.3 6.64,30.31 5.69,31.26 5.69,32.77 MOT1.1
VIN
  Top 0.152: LED1.A 4.8,16.93 5.08,17.21 5.08,23.2 4.05,24.23 2.79,24.23 CHG.2
  Bottom 0.152: 8.32,22.73 7.11,23.94 6.36,23.94 4.9,25.4 CHG.2 | 8.32,22.73 9.63,22.73 10.2,22.16 C9.1 | U3.4 8.32,22.73

### Text on the board
tPlace: - | + | GND | +V | - | + | GND | +V | GND | GND | TXD | RXD | 2 | 8 | - | + | - | + | 1 | 7